# Altium schematic sheet My_STM32_BOARDSCH.SchDoc
size A4
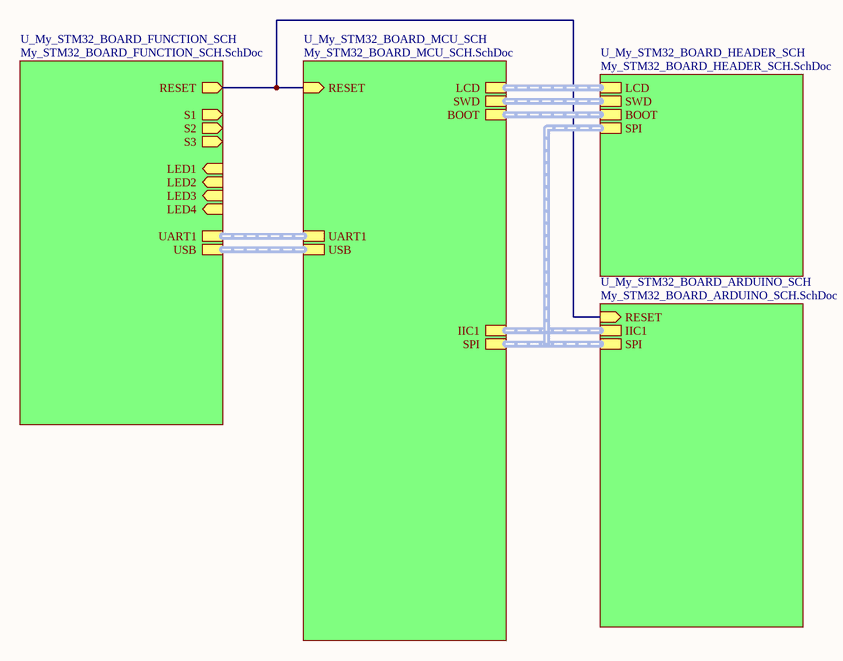
[diagram p0: My_STM32_BOARDSCH.SchDoc]

## Sub-sheets
U_My_STM32_BOARD_ARDUINO_SCH = My_STM32_BOARD_ARDUINO_SCH.SchDoc: IIC1 (harness IIC1), SPI (harness SPI), RESET (in)
U_My_STM32_BOARD_FUNCTION_SCH = My_STM32_BOARD_FUNCTION_SCH.SchDoc: LED1 (in), LED2 (in), LED3 (in), LED4 (in), S1 (out), S2 (out), S3 (out), RESET (out), UART1 (harness UART1), USB (harness USB)
U_My_STM32_BOARD_HEADER_SCH = My_STM32_BOARD_HEADER_SCH.SchDoc: LCD (harness FSMC), SWD (harness SWD), BOOT (harness BOOT), SPI (harness SPI)
U_My_STM32_BOARD_MCU_SCH = My_STM32_BOARD_MCU_SCH.SchDoc: RESET (in), USB (harness USB), UART1 (harness UART1), LCD (harness FSMC), SWD (harness SWD), SPI (harness SPI), IIC1 (harness IIC1), BOOT (harness BOOT)

## Nets
(unnamed): sheet U_My_STM32_BOARD_FUNCTION_SCH/RESET, sheet U_My_STM32_BOARD_MCU_SCH/RESET, sheet U_My_STM32_BOARD_ARDUINO_SCH/RESET

## Buses and harness runs
harness sheet U_My_STM32_BOARD_ARDUINO_SCH/IIC1 = sheet U_My_STM32_BOARD_MCU_SCH/IIC1
harness sheet U_My_STM32_BOARD_ARDUINO_SCH/SPI = sheet U_My_STM32_BOARD_HEADER_SCH/SPI = sheet U_My_STM32_BOARD_MCU_SCH/SPI
harness sheet U_My_STM32_BOARD_FUNCTION_SCH/UART1 = sheet U_My_STM32_BOARD_MCU_SCH/UART1
harness sheet U_My_STM32_BOARD_FUNCTION_SCH/USB = sheet U_My_STM32_BOARD_MCU_SCH/USB
harness sheet U_My_STM32_BOARD_HEADER_SCH/BOOT = sheet U_My_STM32_BOARD_MCU_SCH/BOOT
harness sheet U_My_STM32_BOARD_HEADER_SCH/LCD = sheet U_My_STM32_BOARD_MCU_SCH/LCD
harness sheet U_My_STM32_BOARD_HEADER_SCH/SWD = sheet U_My_STM32_BOARD_MCU_SCH/SWD